# EAGLE schematic main (EAGLE 5.10)

## Sheet 1 of 2
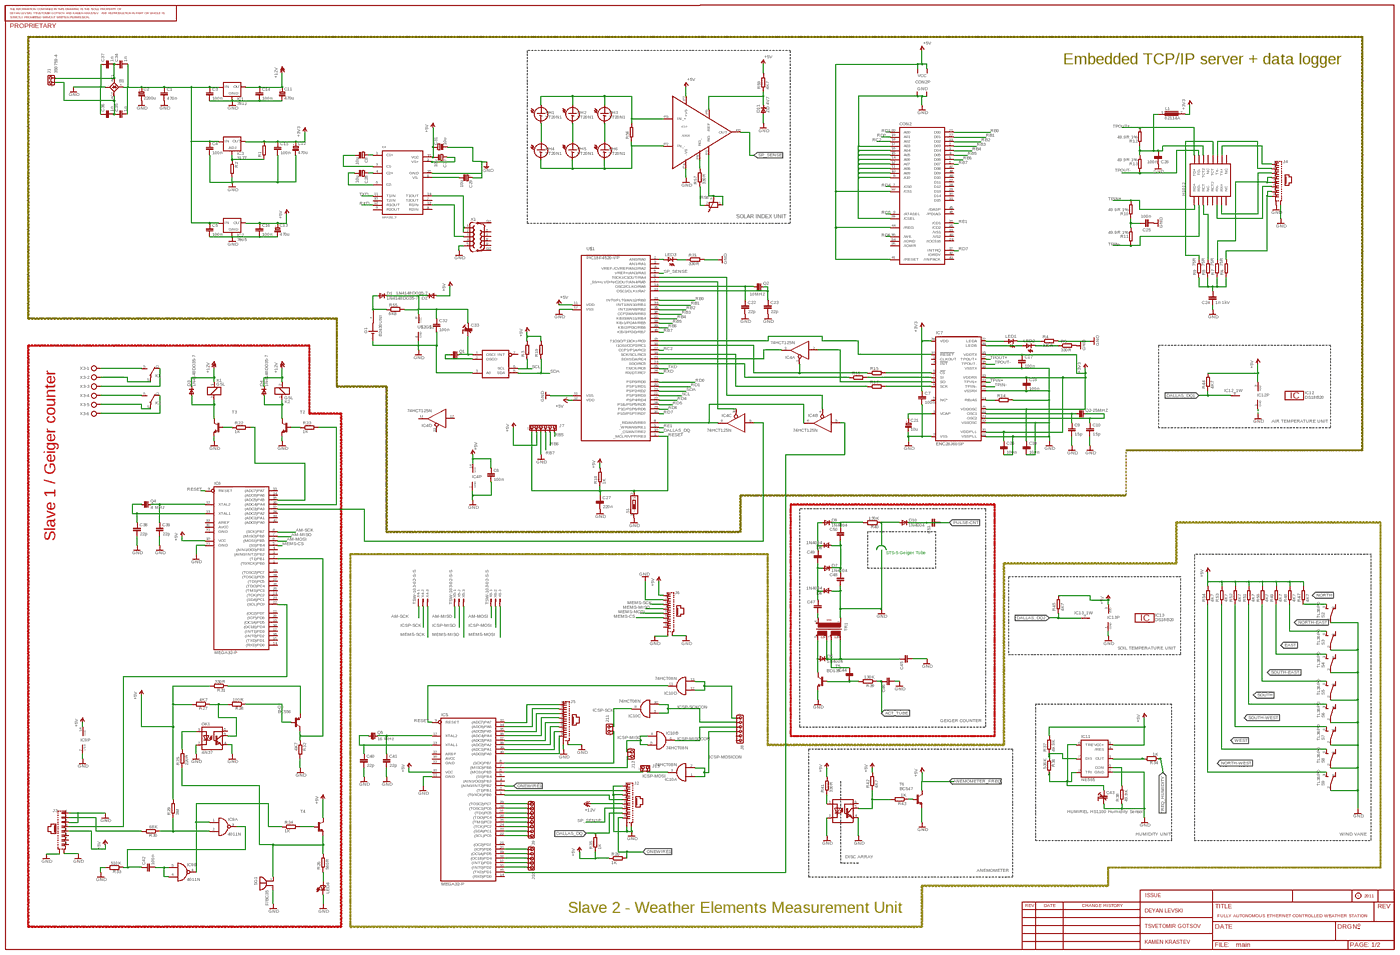
[diagram p0: schematic, sheet 1, overview]
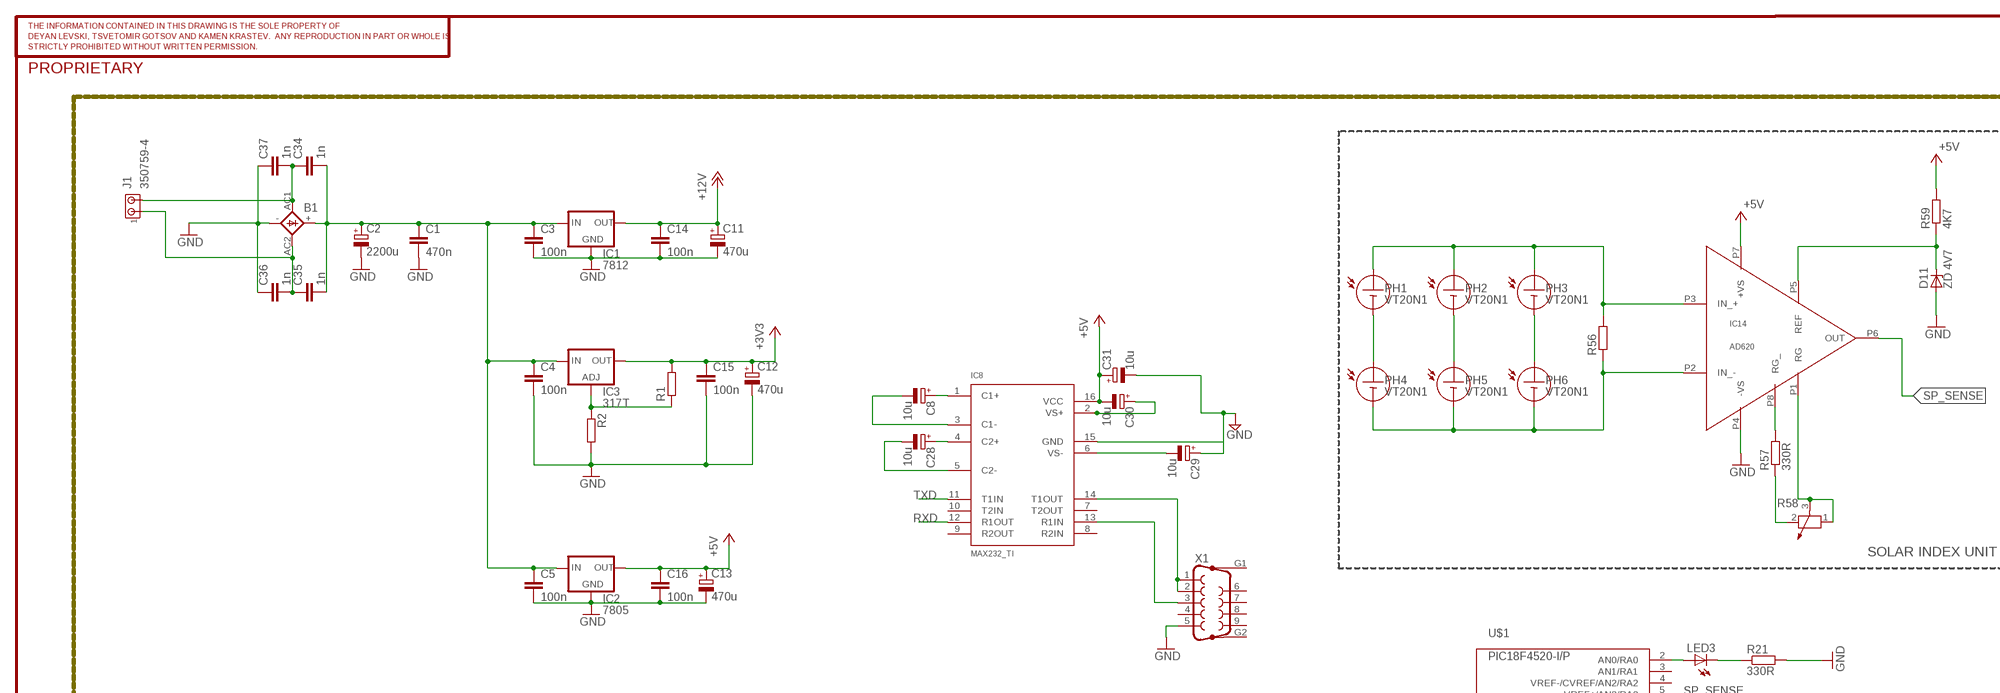
[diagram p1: schematic, sheet 1, part 1 of 4]
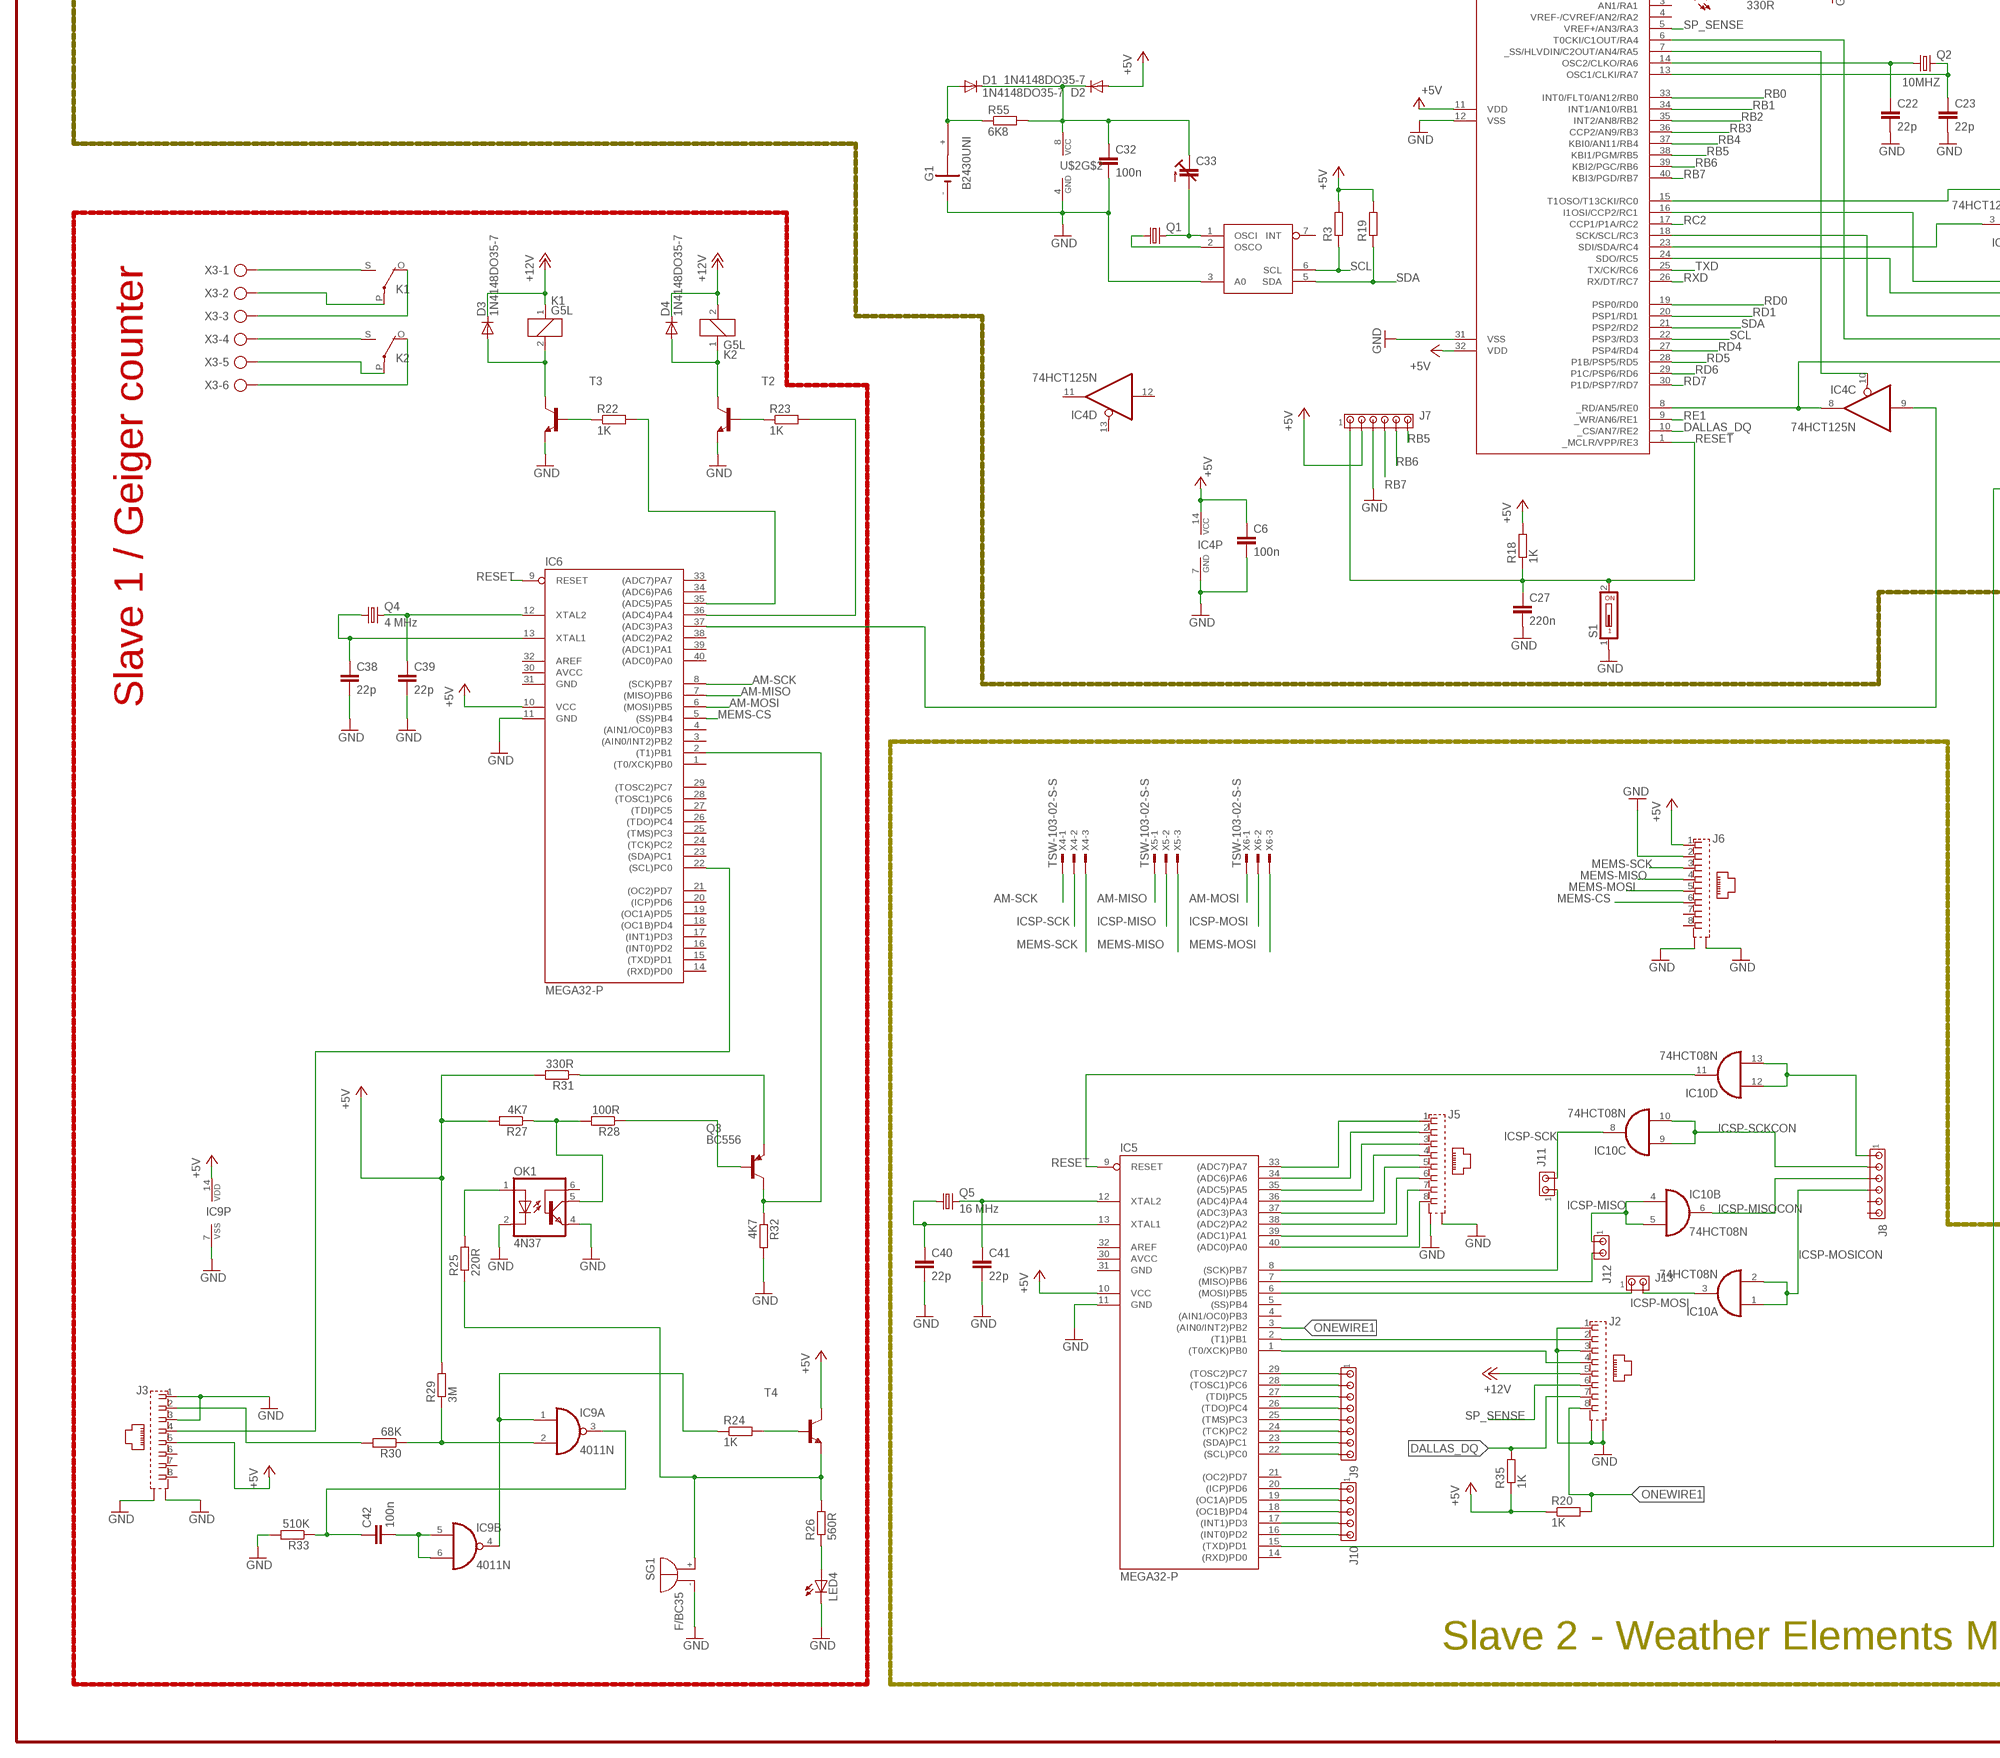
[diagram p2: schematic, sheet 1, part 2 of 4]
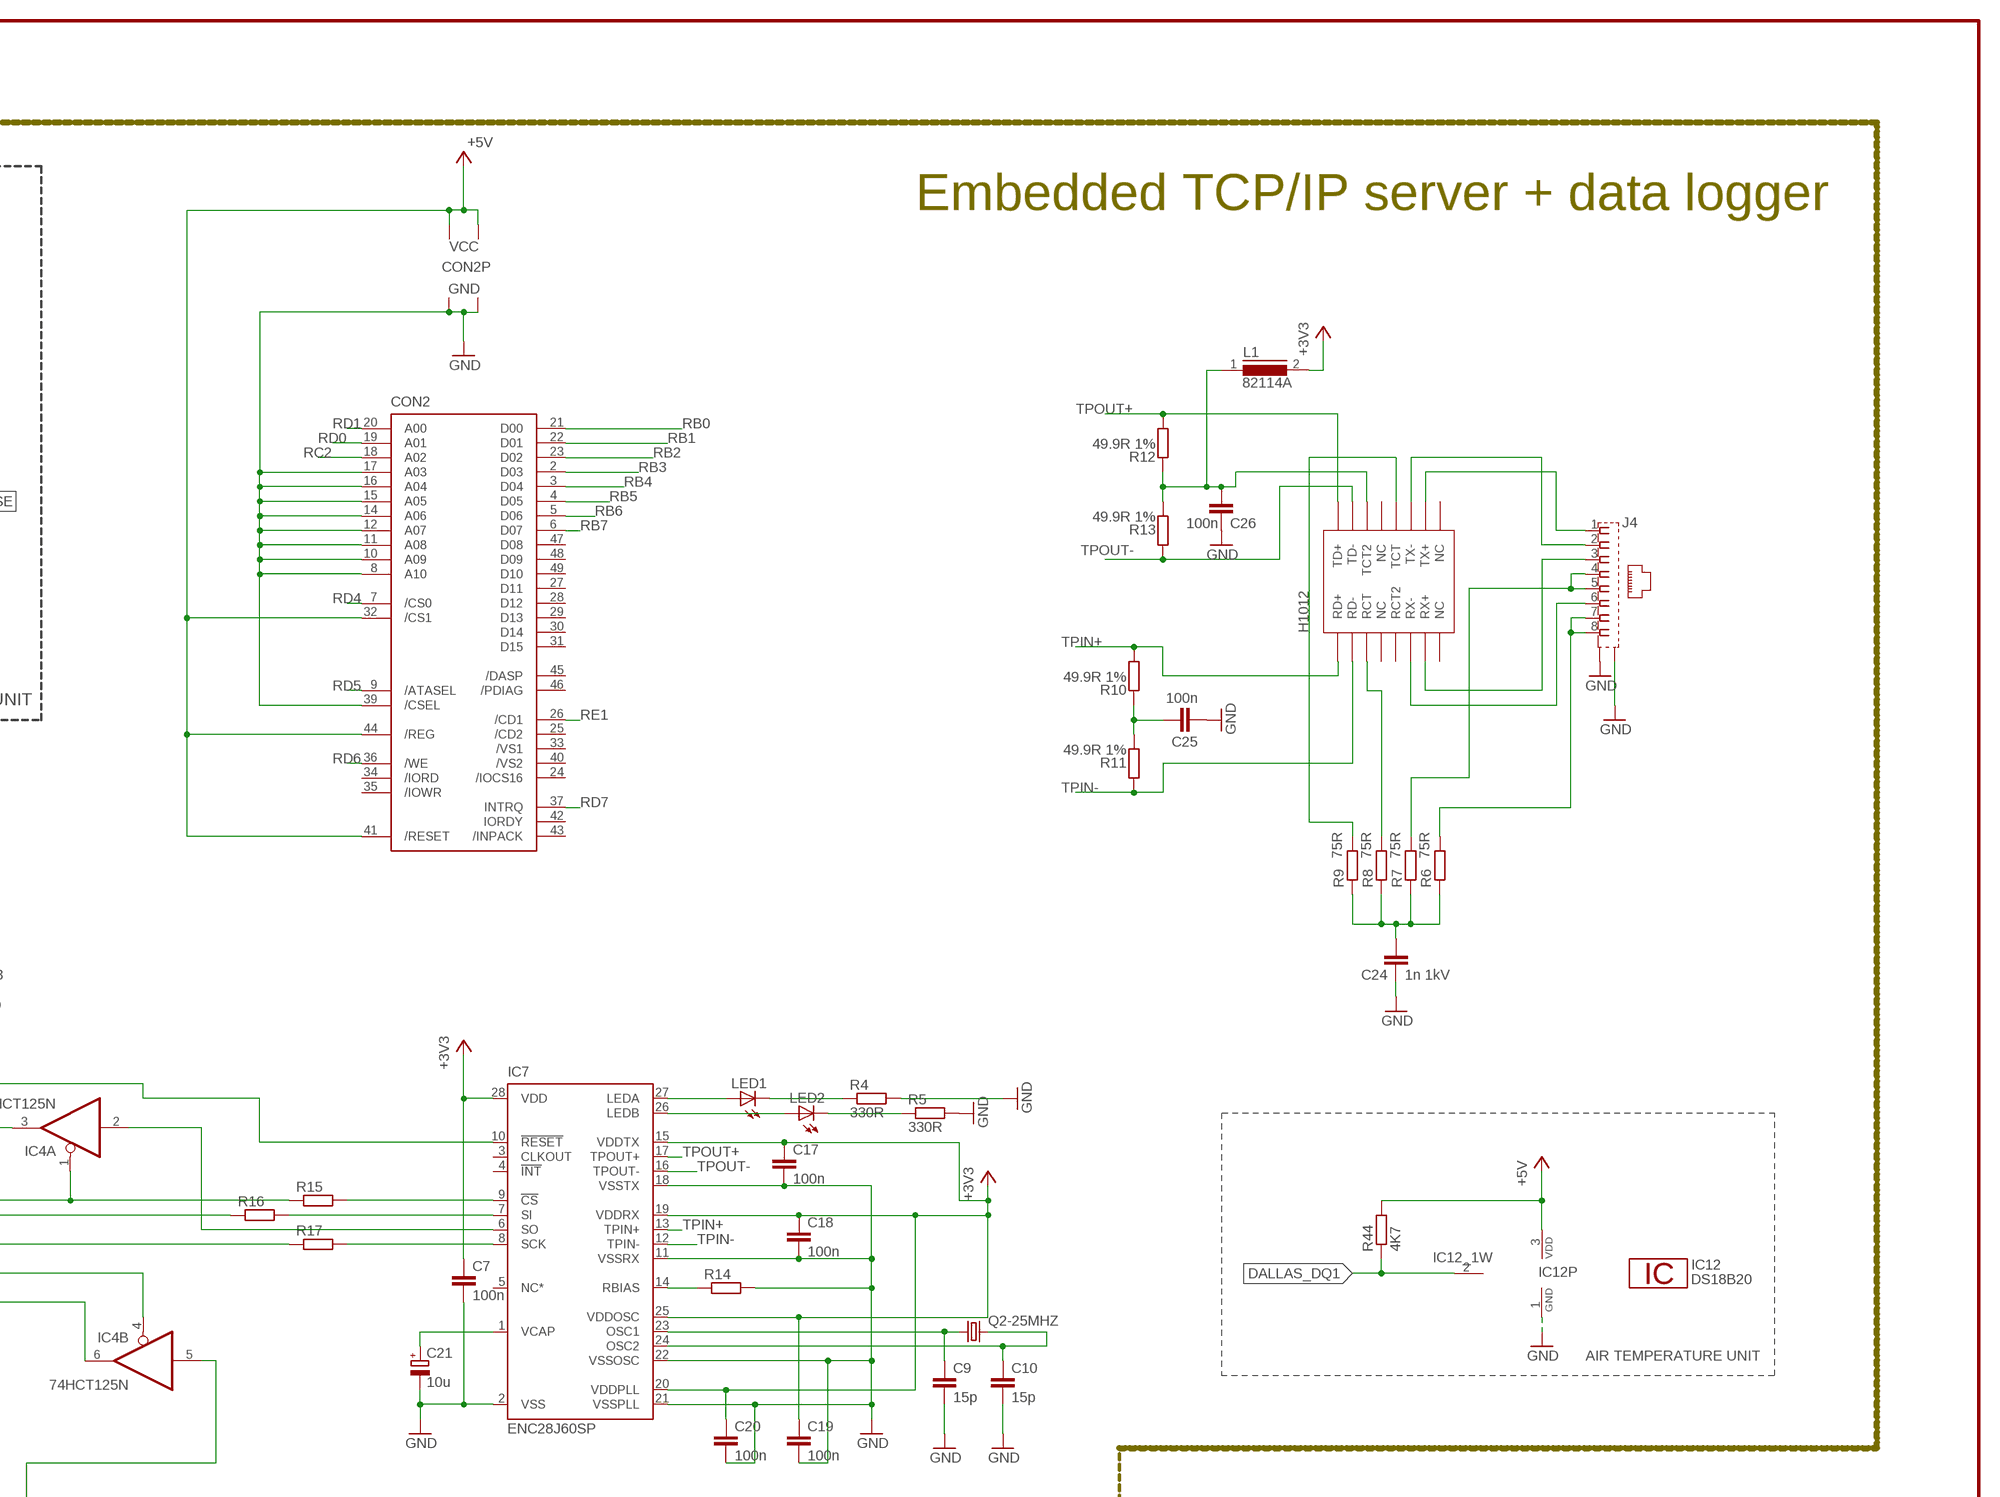
[diagram p3: schematic, sheet 1, part 3 of 4]
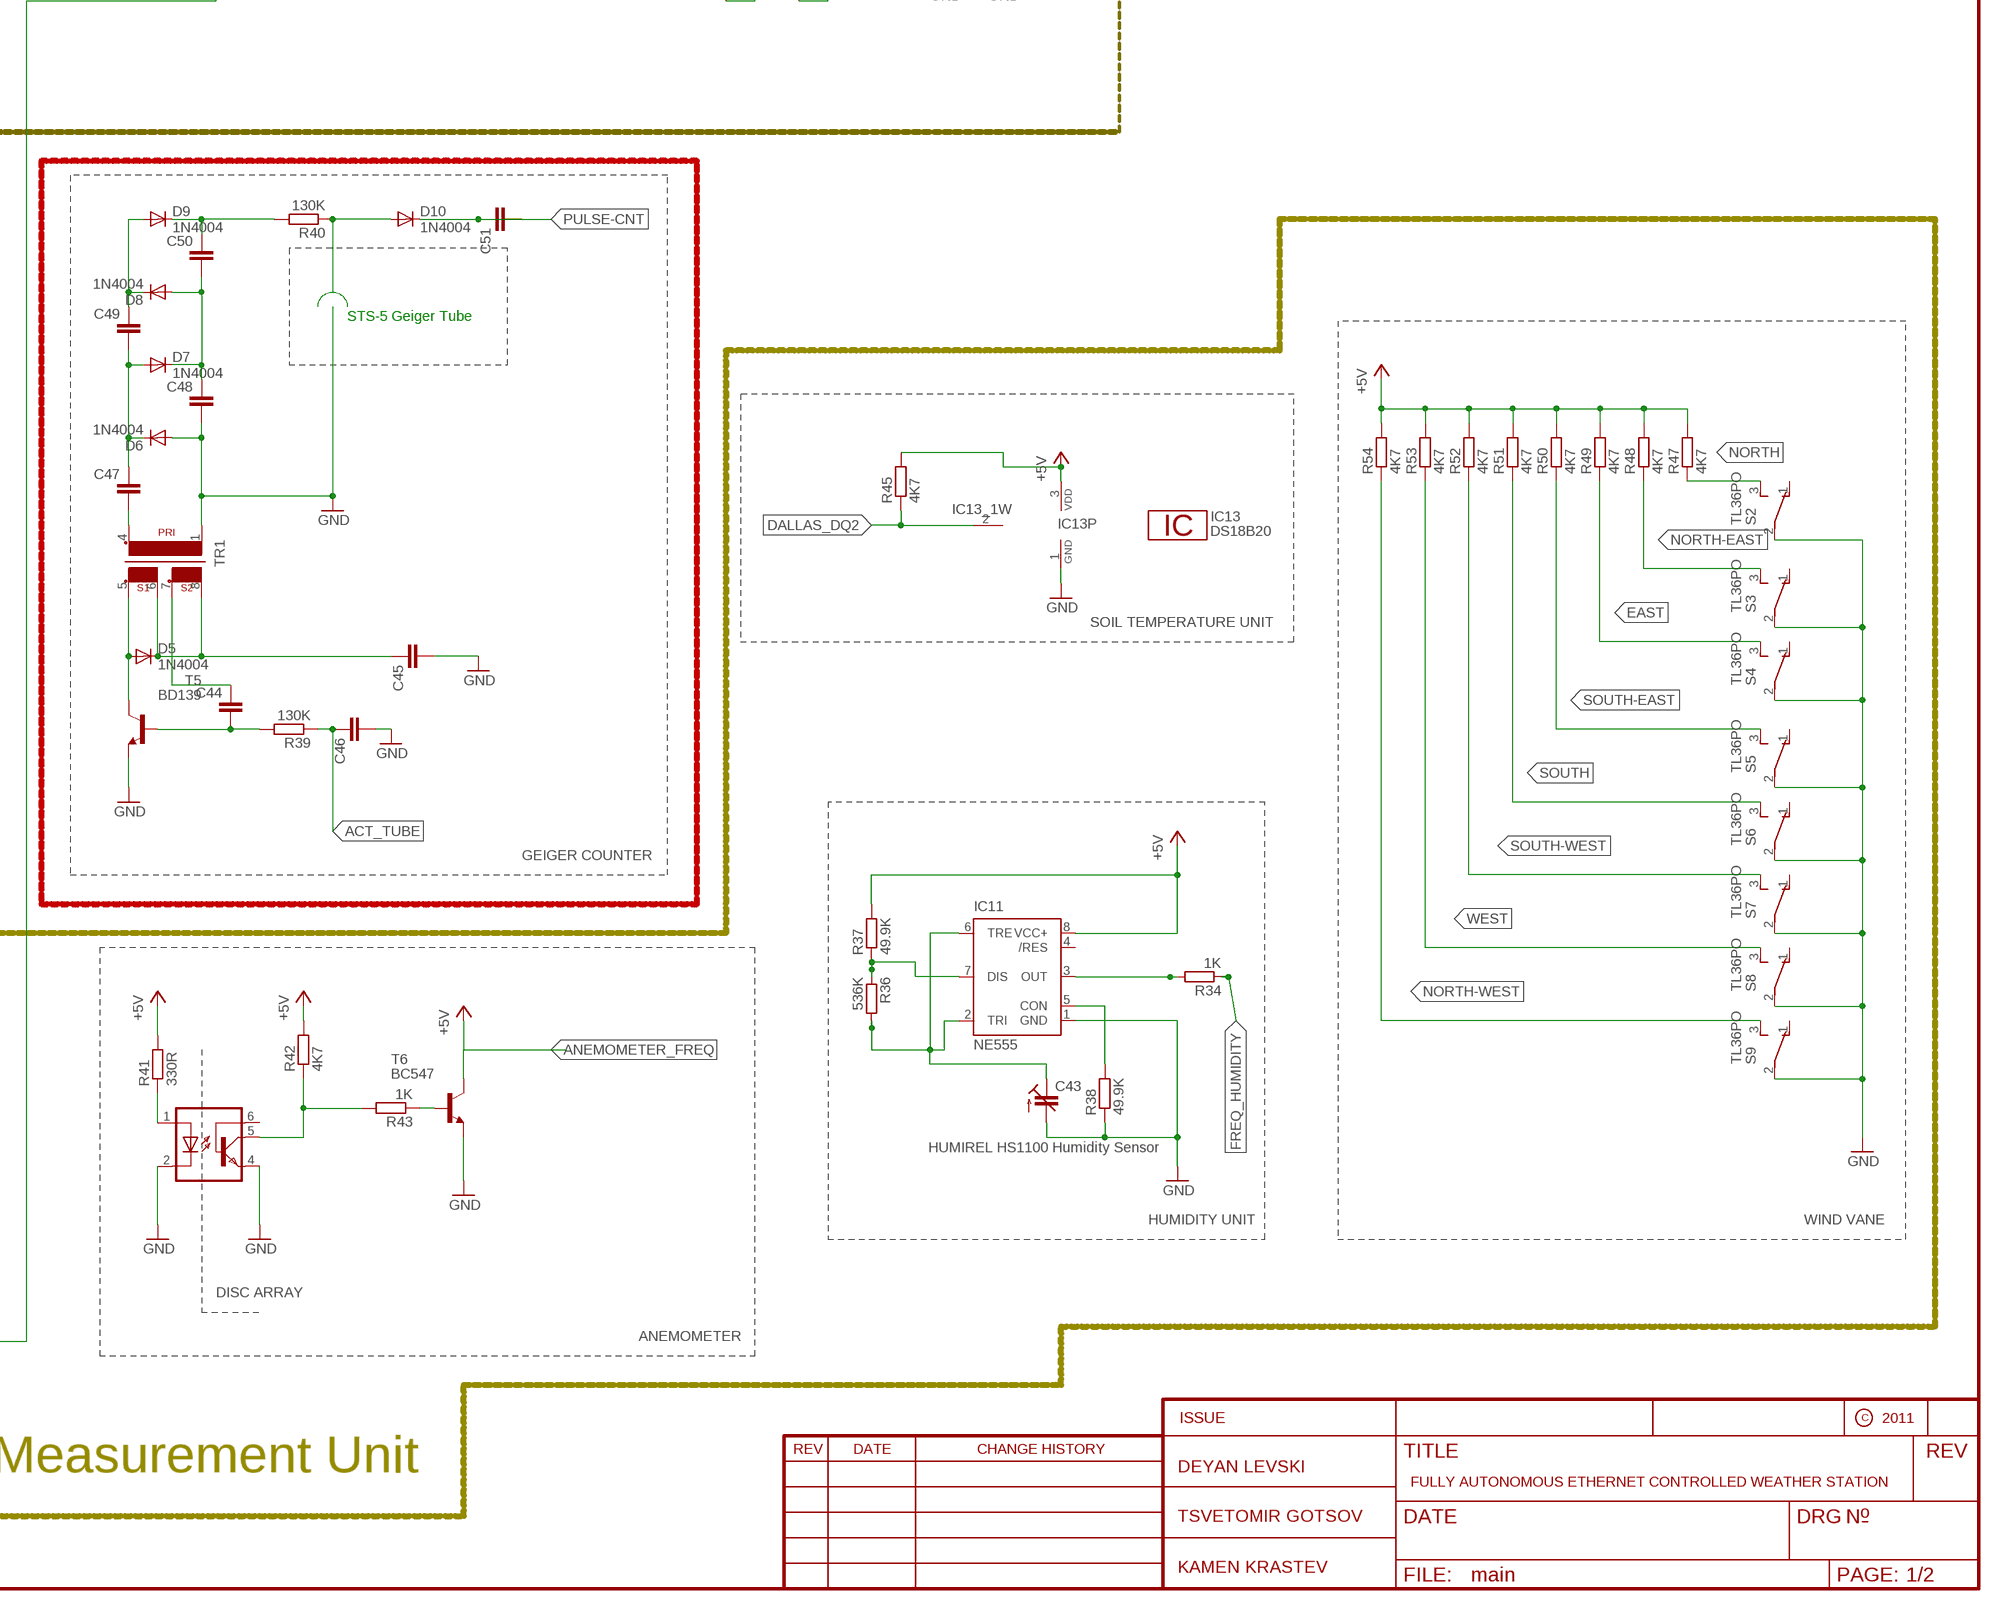
[diagram p4: schematic, sheet 1, part 4 of 4]

### Parts
B1  SKBB  [SKBB]
C1  470n  C-EU050-050X075  [C050-050X075]
C2  2200u  CPOL-EUE5-13  [E5-13]
C3  100n  C-EU050-025X075  [C050-025X075]
C4  100n  C-EU050-025X075  [C050-025X075]
C5  100n  C-EU050-025X075  [C050-025X075]
C6  100n  C-EU050-025X075  [C050-025X075]
C7  100n  C-EU050-025X075  [C050-025X075]
C8  10u  CPOL-EUE2.5-6  [E2,5-6]
C9  15p  C-EU050-024X044  [C050-024X044]
C10  15p  C-EU050-024X044  [C050-024X044]
C11  470u  CPOL-EUE5-10.5  [E5-10,5]
C12  470u  CPOL-EUE5-10.5  [E5-10,5]
C13  470u  CPOL-EUE5-10.5  [E5-10,5]
C14  100n  C-EU050-025X075  [C050-025X075]
C15  100n  C-EU050-025X075  [C050-025X075]
C16  100n  C-EU050-025X075  [C050-025X075]
C17  100n  C-EU050-025X075  [C050-025X075]
C18  100n  C-EU050-025X075  [C050-025X075]
C19  100n  C-EU050-025X075  [C050-025X075]
C20  100n  C-EU050-025X075  [C050-025X075]
C21  10u  CPOL-EUE2.5-6  [E2,5-6]
C22  22p  C-EU050-024X044  [C050-024X044]
C23  22p  C-EU050-024X044  [C050-024X044]
C24  1n 1kV  C-EU050-025X075  [C050-025X075]
C25  100n  C-EU050-025X075  [C050-025X075]
C26  100n  C-EU050-025X075  [C050-025X075]
C27  220n  C-EU050-050X075  [C050-050X075]
C28  10u  CPOL-EUE2.5-6  [E2,5-6]
C29  10u  CPOL-EUE2.5-6  [E2,5-6]
C30  10u  CPOL-EUE2.5-6  [E2,5-6]
C31  10u  CPOL-EUE2.5-6  [E2,5-6]
C32  100n  C-EU050-025X075  [C050-025X075]
C33  C-TRIMM808-1  [CTRIM808-1]
C34  1n  C-EU050-025X075  [C050-025X075]
C35  1n  C-EU050-025X075  [C050-025X075]
C36  1n  C-EU050-025X075  [C050-025X075]
C37  1n  C-EU050-025X075  [C050-025X075]
C38  22p  C-EU050-024X044  [C050-024X044]
C39  22p  C-EU050-024X044  [C050-024X044]
C40  22p  C-EU050-024X044  [C050-024X044]
C41  22p  C-EU050-024X044  [C050-024X044]
C42  100n  C-EU050-025X075  [C050-025X075]
C43  HUMIREL HS1100 Humidity Sensor  C-TRIMM808-1  [CTRIM808-1]
C44  C5/2.5  [C5B2.5]
C45  C5/2.5  [C5B2.5]
C46  C5/2.5  [C5B2.5]
C47  C5/2.5  [C5B2.5]
C48  C5/2.5  [C5B2.5]
C49  C5/2.5  [C5B2.5]
C50  C5/2.5  [C5B2.5]
C51  C5/2.5  [C5B2.5]
CON2  CF-CARD-IDE_MODE  [MI20-50PD-SF]
D1  1N4148DO35-7  [DO35-7]
D2  1N4148DO35-7  [DO35-7]
D3  1N4148DO35-7  [DO35-7]
D4  1N4148DO35-7  [DO35-7]
D5  1N4004  [DO41-10]
D6  1N4004  [DO41-10]
D7  1N4004  [DO41-10]
D8  1N4004  [DO41-10]
D9  1N4004  [DO41-10]
D10  1N4004  [DO41-10]
D11  ZD 4V7  ZENER-DIODEF126-12  [F126Z12]
G1  B2430UNI  [B2430UNI]
IC1  7812  78XXS  [78XXS]
IC2  7805  78XXS  [78XXS]
IC3  317T  LM317TS  [317TS]
IC4  74HCT125N  [DIL14]
IC5  MEGA32-P  [DIL40]
IC6  MEGA32-P  [DIL40]
IC7  ENC28J60SP  [DIL28-3]
IC8  MAX232_TI  [DIL16]
IC9  4011N  [DIL14]
IC10  74HCT08N  [DIL14]
IC11  NE555  [DIL-08]
IC12  DS18B20  [TO92-]
IC13  DS18B20  [TO92-]
IC14  AD620  [DIL8]
J1  350759-4  [350759-4]
J2  555141-1  [555153-1]
J3  555141-1  [555153-1]
J4  555141-1  [555153-1]
J5  555141-1  [555153-1]
J6  555141-1  [555153-1]
J7  MTA06-100  [10X06MTA]
J8  MTA06-100  [10X06MTA]
J9  MTA08-100  [10X08MTA]
J10  MTA05-100  [10X05MTA]
J11  MTA02-100  [10X02MTA]
J12  MTA02-100  [10X02MTA]
J13  MTA02-100  [10X02MTA]
K1  G5L  [G5LE]
K2  G5L  [G5LE]
L1  82114A  [82114A]
LED1  LED3MM  [LED3MM]
LED2  LED3MM  [LED3MM]
LED3  LED3MM  [LED3MM]
LED4  LED3MM  [LED3MM]
OK1  4N37  [DIL06]
OK2  4N35  [DIL06]
PH1  VT20N1  [TO46-VT200]
PH2  VT20N1  [TO46-VT200]
PH3  VT20N1  [TO46-VT200]
PH4  VT20N1  [TO46-VT200]
PH5  VT20N1  [TO46-VT200]
PH6  VT20N1  [TO46-VT200]
Q1  CRYSTALTC26H  [TC26H]
Q2  10MHZ  CRYSTALHC49U-V  [HC49U-V]
Q2-25MHZ  CRYSTALHC49U-V  [HC49U-V]
Q3  BC556  [TO92-EBC]
Q4  4 MHz  CRYSTALHC49U-V  [HC49U-V]
Q5  16 MHz  CRYSTALHC49U-V  [HC49U-V]
R1  R-EU_0207/10  [0207/10]
R2  R-EU_0207/10  [0207/10]
R3  R-EU_0207/10  [0207/10]
R4  330R  R-EU_0207/2V  [0207/2V]
R5  330R  R-EU_0207/2V  [0207/2V]
R6  75R  R-EU_0309/10  [0309/10]
R7  75R  R-EU_0309/10  [0309/10]
R8  75R  R-EU_0309/10  [0309/10]
R9  75R  R-EU_0309/10  [0309/10]
R10  49.9R 1%  R-EU_0309/10  [0309/10]
R11  49.9R 1%  R-EU_0309/10  [0309/10]
R12  49.9R 1%  R-EU_0309/10  [0309/10]
R13  49.9R 1%  R-EU_0309/10  [0309/10]
R14  R-EU_0207/10  [0207/10]
R15  R-EU_0207/10  [0207/10]
R16  R-EU_0207/10  [0207/10]
R17  R-EU_0207/10  [0207/10]
R18  1K  R-EU_0207/10  [0207/10]
R19  R-EU_0207/10  [0207/10]
R20  1K  R-EU_0207/15  [0207/15]
R21  330R  R-EU_0207/2V  [0207/2V]
R22  1K  R-EU_0207/10  [0207/10]
R23  1K  R-EU_0207/10  [0207/10]
R24  1K  R-EU_0207/10  [0207/10]
R25  220R  R-EU_0207/10  [0207/10]
R26  560R  R-EU_0207/10  [0207/10]
R27  4K7  R-EU_0207/10  [0207/10]
R28  100R  R-EU_0207/10  [0207/10]
R29  3M  R-EU_0207/10  [0207/10]
R30  68K  R-EU_0207/10  [0207/10]
R31  330R  R-EU_0207/10  [0207/10]
R32  4K7  R-EU_0207/10  [0207/10]
R33  510K  R-EU_0207/10  [0207/10]
R34  1K  R-EU_0207/15  [0207/15]
R35  1K  R-EU_0207/15  [0207/15]
R36  536K  R-EU_0207/15  [0207/15]
R37  49.9K  R-EU_0207/10  [0207/10]
R38  49.9K  R-EU_0207/10  [0207/10]
R39  130K  R-EU_0207/10  [0207/10]
R40  130K  R-EU_0207/10  [0207/10]
R41  330R  R-EU_0207/10  [0207/10]
R42  4K7  R-EU_0207/10  [0207/10]
R43  1K  R-EU_0207/10  [0207/10]
R44  4K7  R-EU_0207/10  [0207/10]
R45  4K7  R-EU_0207/10  [0207/10]
R47  4K7  R-EU_0207/10  [0207/10]
R48  4K7  R-EU_0207/10  [0207/10]
R49  4K7  R-EU_0207/10  [0207/10]
R50  4K7  R-EU_0207/10  [0207/10]
R51  4K7  R-EU_0207/10  [0207/10]
R52  4K7  R-EU_0207/10  [0207/10]
R53  4K7  R-EU_0207/10  [0207/10]
R54  4K7  R-EU_0207/10  [0207/10]
R55  6K8  R-EU_0207/10  [0207/10]
R56  R-EU_0207/10  [0207/10]
R57  330R  R-EU_0207/2V  [0207/2V]
R58  POTENTIOMETER_PT-10  [PT-10]
R59  4K7  R-EU_0207/2V  [0207/2V]
S1  DS01  [DS-01]
S2  TL36PO  [TL3XPO]
S3  TL36PO  [TL3XPO]
S4  TL36PO  [TL3XPO]
S5  TL36PO  [TL3XPO]
S6  TL36PO  [TL3XPO]
S7  TL36PO  [TL3XPO]
S8  TL36PO  [TL3XPO]
S9  TL36PO  [TL3XPO]
SG1  F/BC35  [F/BC35]
T1  WE-LAN-16PIN_749010011  [WE-LAN_7491010/3]
T2  BC550C-NPN-TO92-EBC  [TO92-EBC]
T3  BC550C-NPN-TO92-EBC  [TO92-EBC]
T4  BC550C-NPN-TO92-EBC  [TO92-EBC]
T5  BD139  [TO126]
T6  BC547  [TO92]
TR1  EE20-2  [EE20-2]
U$1  PIC18F4520-I/P  [DIL40]
U$2  PCF8583P  [DIL08]
X1  F09HP  [F09HP]
X3  AK500/6  [AK500/6]
X4  TSW-103-02-S-S  [TSW-103-02-S-S]
X5  TSW-103-02-S-S  [TSW-103-02-S-S]
X6  TSW-103-02-S-S  [TSW-103-02-S-S]

### Nets
+3V3: C7.1 C12.+ C15.1 C17.1 C18.1 C19.1 C20.1 IC3.2(OUT) IC7.15(VDDTX) IC7.19(VDDRX) IC7.20(VDDPLL) IC7.25(VDDOSC) IC7.28(VDD) L1.2 R1.2
+5V: C6.1 C13.+ C16.1 C30.- C31.+ CON2.13(VCC2) CON2.32(/CS1) CON2.38(VCC1) CON2.41(/RESET) CON2.44(/REG) D2.A IC2.OUT IC4.14(P:VCC) IC5.10(VCC) IC6.10(VCC) IC8.16(VCC) IC9.14(P:VDD) IC11.8(VCC+) IC12.3 IC13.3 IC14.P7(+VS) J3.5 J6.1 J7.5 R3.2 R18.2 R19.2 R20.1 R27.2 R29.2 R31.2 R35.1 R37.2 R41.2 R42.2 R44.2 R45.2 R47.2 R48.2 R49.2 R50.2 R51.2 R52.2 R53.2 R54.2 R59.2 T4.C U$1.11(VDD) U$1.32(VDD)
+12V: C11.+ C14.1 D3.C D4.C IC1.OUT J2.5 K1.1 K2.2
ACT_TUBE: C46.1 R39.1
AM-MISO: IC6.7((MISO)PB6) X5.1
AM-MOSI: IC6.6((MOSI)PB5) X6.1
AM-SCK: IC6.8((SCK)PB7) X4.1
ANEMOMETER_FREQ: T6.3(C) ; supply symbol labelled +5V
DALLAS_DQ: J2.7 R35.2 U$1.10(_CS/AN7/RE2)
DALLAS_DQ1: IC12.2 R44.1
DALLAS_DQ2: IC13.2 R45.1
EAST: R50.1 S5.3(S)
FREQ_HUMIDITY: R34.1
GND: B1.- C1.2 C2.- C3.2 C4.2 C5.2 C6.2 C7.2 C9.2 C10.2 C11.- C12.- C13.- C14.2 C15.2 C16.2 C17.2 C18.2 C19.2 C20.2 C21.- C22.2 C23.2 C24.1 C25.1 C26.2 C27.2 C32.2 C36.1 C37.1 C38.2 C39.2 C40.2 C41.2 C43.2(A) C45.2 C46.2 C48.2 CON2.1(GND1) CON2.8(A10) CON2.10(A09) CON2.11(A08) CON2.12(A07) CON2.14(A06) CON2.15(A05) CON2.16(A04) CON2.17(A03) CON2.39(/CSEL) CON2.50(GND2) D6.A D11.A G1.- IC1.GND IC2.GND IC4.7(P:GND) IC5.11(GND) IC6.11(GND) IC7.2(VSS) IC7.11(VSSRX) IC7.18(VSSTX) IC7.21(VSSPLL) IC7.22(VSSOSC) IC9.7(P:VSS) IC11.1(GND) IC12.1 IC13.1 IC14.P4(-VS) J2.1 J2.3 J2.G1(S1) J2.G2(S2) J3.1 J3.3 J3.G1(S1) J3.G2(S2) J4.G1(S1) J4.G2(S2) J5.G1(S1) J5.G2(S2) J6.2 J6.G1(S1) J6.G2(S2) J7.4 LED4.K(C) OK1.2(C) OK1.4(EMI) OK2.2(C) OK2.4(EMI) R2.2 R4.2 R5.2 R14.2 R21.2 R32.2 R33.2 R38.1 S1.1 S2.2(P) S3.2(P) S4.2(P) S5.2(P) S6.2(P) S7.2(P) S8.2(P) S9.2(P) SG1.- T2.E T3.E T5.1(E) T6.1(E) TR1.1 U$1.12(VSS) U$1.31(VSS) U$2.3(A0) U$2.4(GND) X1.5
ICSP-MISO: IC10.4(B:I0) IC10.5(B:I1) J12.1 X5.2
ICSP-MISOCON: IC10.6(B:O) J8.4
ICSP-MOSI: IC10.3(A:O) J13.2 X6.2
ICSP-MOSICON: IC10.1(A:I0) IC10.2(A:I1) J8.3
ICSP-SCK: IC10.8(C:O) J11.2 X4.2
ICSP-SCKCON: IC10.9(C:I0) IC10.10(C:I1) J8.5
MEMS-CS: IC6.5((SS)PB4) J6.6
MEMS-MISO: J6.4 X5.3
MEMS-MOSI: J6.5 X6.3
MEMS-SCK: J6.3 X4.3
N$1: B1.AC1 C34.1 C37.2 J1.2
N$2: B1.AC2 C35.1 C36.2 J1.1
N$3: B1.+ C1.1 C2.+ C3.1 C4.1 C5.1 C34.2 C35.2 IC1.IN IC2.IN IC3.3(IN)
N$4: IC4.3(A:O) U$1.23(SDI/SDA/RC4)
N$5: IC3.1(ADJ) R1.1 R2.1
N$6: IC7.8(SCK) R17.2
N$7: C9.1 IC7.23(OSC1) Q2-25MHZ.1
N$8: R17.1 U$1.18(SCK/SCL/RC3)
N$9: C10.1 IC7.24(OSC2) Q2-25MHZ.2
N$10: J4.1 T1.10(TX+)
N$11: IC7.27(LEDA) LED1.A
N$12: IC7.26(LEDB) LED2.A
N$13: LED1.K(C) R4.1
N$14: LED2.K(C) R5.1
N$15: C21.+ IC7.1(VCAP)
N$16: IC7.14(RBIAS) R14.1
N$17: IC4.2(A:I) IC7.6(SO)
N$18: IC7.9(!CS) R15.2
N$19: IC7.10(!RESET) U$1.15(T1OSO/T13CKI/RC0)
N$20: IC4.1(A:OE) R15.1 U$1.16(I1OSI/CCP2/RC1)
N$21: J4.2 T1.11(TX-)
N$22: IC7.7(SI) R16.2
N$23: R16.1 U$1.24(SDO/RC5)
N$24: C22.1 Q2.1 U$1.14(OSC2/CLKO/RA6)
N$25: C23.1 Q2.2 U$1.13(OSC1/CLKI/RA7)
N$26: IC4.9(C:I) IC6.37((ADC3)PA3)
N$27: IC8.14(T1OUT) X1.1 X1.2
N$28: D1.A G1.+ R55.1
N$30: C33.2(A) Q1.2 U$2.1(OSCI)
N$31: Q1.1 U$2.2(OSCO)
N$32: C32.1 C33.1(E) D1.C D2.C R55.2 U$2.8(VCC)
N$33: LED3.K(C) R21.1
N$34: LED3.A U$1.2(AN0/RA0)
N$35: J4.3 T1.7(RX+)
N$36: IC4.6(B:O) IC4.8(C:O) U$1.8(_RD/AN5/RE0)
N$37: IC4.10(C:OE) U$1.7(_SS/HLVDIN/C2OUT/AN4/RA5)
N$38: J4.6 T1.6(RX-)
N$39: R9.2 T1.12(TCT)
N$40: IC4.4(B:OE) U$1.6(T0CKI/C1OUT/RA4)
N$41: IC8.13(R1IN) X1.3
N$42: C39.1 IC6.12(XTAL2) Q4.2
N$43: C38.1 IC6.13(XTAL1) Q4.1
N$44: R8.2 T1.3(RCT)
N$45: J4.4 J4.5 R7.2
N$46: C41.1 IC5.12(XTAL2) Q5.2
N$47: C40.1 IC5.13(XTAL1) Q5.1
N$49: D3.A K1.2 T3.C
N$50: D4.A K2.1 T2.C
N$51: IC6.36((ADC4)PA4) R23.2
N$52: IC6.35((ADC5)PA5) R22.2
N$53: R22.1 T3.B
N$54: R23.1 T2.B
N$55: K1.S(2:S) X3.1
N$56: K1.P(2:P) X3.2
N$57: K1.O(2:O) X3.3
N$58: K2.S(2:S) X3.4
N$59: K2.P(2:P) X3.5
N$60: J4.7 J4.8 R6.2
N$61: K2.O(2:O) X3.6
N$62: C24.2 R6.1 R7.1 R8.1 R9.1
N$63: IC9.1(A:I0) IC9.4(B:O) R24.1
N$64: R24.2 T4.B
N$65: IC9.2(A:I1) R29.1 R30.1
N$66: C25.2 R10.1 R11.2
N$67: R25.1 R26.2 SG1.+ T4.E
N$68: LED4.A R26.1
N$69: OK1.1(A) R25.2
N$71: OK1.5(COL) R27.1 R28.2
N$72: Q3.E R31.1
N$73: IC6.2((T1)PB1) Q3.C R32.1
N$74: Q3.B R28.1
N$75: C42.2 IC9.5(B:I0) IC9.6(B:I1)
N$76: C42.1 IC9.3(A:O) R33.1
N$77: C29.- IC8.6(VS-)
N$78: C26.1 L1.1 R12.1 R13.2 T1.14(TCT2)
N$80: J3.2 R30.2
N$81: IC6.22((SCL)PC0) J3.4
N$82: IC4.5(B:I) IC5.15((TXD)PD1)
N$89: C30.+ IC8.2(VS+)
N$90: C8.+ IC8.1(C1+)
N$93: C8.- IC8.3(C1-)
N$94: C28.+ IC8.4(C2+)
N$96: C28.- IC8.5(C2-)
N$97: IC5.40((ADC0)PA0) J5.8
N$98: IC5.39((ADC1)PA1) J5.7
N$99: C29.+ C31.- IC8.15(GND) ; supply symbol labelled GND
N$100: IC5.38((ADC2)PA2) J5.6
N$101: IC5.37((ADC3)PA3) J5.5
N$102: IC5.36((ADC4)PA4) J5.4
N$103: IC5.35((ADC5)PA5) J5.3
N$104: IC5.34((ADC6)PA6) J5.2
N$105: IC5.33((ADC7)PA7) J5.1
N$106: IC5.2((T1)PB1) J2.2
N$107: IC5.1((T0/XCK)PB0) J2.4
N$111: IC5.6((MOSI)PB5) J13.1
N$113: IC10.12(D:I0) IC10.13(D:I1) J8.6
N$118: IC11.3(OUT) R34.2
N$119: IC5.7((MISO)PB6) J12.2
N$137: IC5.8((SCK)PB7) J11.1
N$138: IC11.7(DIS) R36.1 R37.1
N$139: IC5.29((TOSC2)PC7) J9.1
N$140: IC5.28((TOSC1)PC6) J9.2
N$141: IC5.27((TDI)PC5) J9.3
N$142: IC5.26((TDO)PC4) J9.4
N$143: IC5.25((TMS)PC3) J9.5
N$144: IC5.24((TCK)PC2) J9.6
N$145: IC5.23((SDA)PC1) J9.7
N$146: IC5.22((SCL)PC0) J9.8
N$147: C43.1(E) IC11.2(TRI) IC11.6(TRE) R36.2
N$148: IC5.20((ICP)PD6) J10.1
N$149: IC5.19((OC1A)PD5) J10.2
N$150: IC5.18((OC1B)PD4) J10.3
N$151: IC5.17((INT1)PD3) J10.4
N$152: IC5.16((INT0)PD2) J10.5
N$153: D5.A T5.2(C) TR1.5
N$154: C45.1 D5.C TR1.6 TR1.8
N$155: C44.1 TR1.7
N$156: C44.2 R39.2 T5.3(B)
N$157: C47.2 TR1.4
N$158: IC11.5(CON) R38.2
N$159: C47.1 C49.2 D6.C D7.A
N$160: OK2.1(A) R41.1
N$161: C48.1 C50.2 D7.C D8.A
N$162: C49.1 D8.C D9.A
N$163: OK2.5(COL) R42.1 R43.2
N$164: C50.1 D9.C R40.2
N$165: R43.1 T6.2(B)
N$166: D10.A R40.1
N$168: IC14.P8(RG_) R57.2
N$169: C51.1 D10.C
N$170: R57.1 R58.2
N$171: IC14.P1(RG) R58.1 R58.3
N$172: D11.C IC14.P5(REF) R59.1
N$174: PH1.2 PH4.1
N$175: PH2.2 PH5.1
N$176: PH3.2 PH6.1
N$177: IC14.P3(IN_+) PH1.1 PH2.1 PH3.1 R56.2
N$178: IC14.P2(IN_-) PH4.2 PH5.2 PH6.2 R56.1
NORTH: R48.1 S3.3(S)
NORTH-EAST: R49.1 S4.3(S)
NORTH-WEST: R47.1 S2.3(S)
ONEWIRE1: IC5.3((AIN0/INT2)PB2) J2.8 R20.2
PULSE-CNT: C51.2
RB0: CON2.21(D00) U$1.33(INT0/FLT0/AN12/RB0)
RB1: CON2.22(D01) U$1.34(INT1/AN10/RB1)
RB2: CON2.23(D02) U$1.35(INT2/AN8/RB2)
RB3: CON2.2(D03) U$1.36(CCP2/AN9/RB3)
RB4: CON2.3(D04) U$1.37(KBI0/AN11/RB4)
RB5: CON2.4(D05) J7.1 U$1.38(KBI1/PGM/RB5)
RB6: CON2.5(D06) J7.2 U$1.39(KBI2/PGC/RB6)
RB7: CON2.6(D07) J7.3 U$1.40(KBI3/PGD/RB7)
RC2: CON2.18(A02) U$1.17(CCP1/P1A/RC2)
RD0: CON2.19(A01) U$1.19(PSP0/RD0)
RD1: CON2.20(A00) U$1.20(PSP1/RD1)
RD4: CON2.7(/CS0) U$1.27(PSP4/RD4)
RD5: CON2.9(/ATASEL) U$1.28(P1B/PSP5/RD5)
RD6: CON2.36(/WE) U$1.29(P1C/PSP6/RD6)
RD7: CON2.37(INTRQ) U$1.30(P1D/PSP7/RD7)
RE1: CON2.26(/CD1) U$1.9(_WR/AN6/RE1)
RESET: C27.1 IC5.9(RESET) IC6.9(RESET) IC10.11(D:O) J7.6 R18.1 S1.2 U$1.1(_MCLR/VPP/RE3)
RXD: IC8.12(R1OUT) U$1.26(RX/DT/RC7)
SCL: R3.1 U$1.22(PSP3/RD3) U$2.6(SCL)
SDA: R19.1 U$1.21(PSP2/RD2) U$2.5(SDA)
SOUTH: R52.1 S7.3(S)
SOUTH-EAST: R51.1 S6.3(S)
SOUTH-WEST: R53.1 S8.3(S)
SP_SENSE: IC14.P6(OUT) J2.6 U$1.5(VREF+/AN3/RA3)
TPIN+: IC7.13(TPIN+) R10.2 T1.1(RD+)
TPIN-: IC7.12(TPIN-) R11.1 T1.2(RD-)
TPOUT+: IC7.17(TPOUT+) R12.2 T1.16(TD+)
TPOUT-: IC7.16(TPOUT-) R13.1 T1.15(TD-)
TXD: IC8.11(T1IN) U$1.25(TX/CK/RC6)
WEST: R54.1 S9.3(S)
Unconnected: CON2.24(/IOCS16) CON2.25(/CD2) CON2.27(D11) CON2.28(D12) CON2.29(D13) CON2.30(D14) CON2.31(D15) CON2.33(/VS1) CON2.34(/IORD) CON2.35(/IOWR) CON2.40(/VS2) CON2.42(IORDY) CON2.43(/INPACK) CON2.45(/DASP) CON2.46(/PDIAG) CON2.47(D08) CON2.48(D09) CON2.49(D10) G1.+@1(+) G1.+@2(+) G1.+@3(+) G1.+@4(+) G1.-@1(-) IC4.11(D:O) IC4.12(D:I) IC4.13(D:OE) IC5.4((AIN1/OC0)PB3) IC5.5((SS)PB4) IC5.14((RXD)PD0) IC5.21((OC2)PD7) IC5.32(AREF) IC6.1((T0/XCK)PB0) IC6.3((AIN0/INT2)PB2) IC6.4((AIN1/OC0)PB3) IC6.14((RXD)PD0) IC6.15((TXD)PD1) IC6.16((INT0)PD2) IC6.17((INT1)PD3) IC6.18((OC1B)PD4) IC6.19((OC1A)PD5) IC6.20((ICP)PD6) IC6.21((OC2)PD7) IC6.23((SDA)PC1) IC6.24((TCK)PC2) IC6.25((TMS)PC3) IC6.26((TDO)PC4) IC6.27((TDI)PC5) IC6.28((TOSC1)PC6) IC6.29((TOSC2)PC7) IC6.32(AREF) IC6.33((ADC7)PA7) IC6.34((ADC6)PA6) IC6.38((ADC2)PA2) IC6.39((ADC1)PA1) IC6.40((ADC0)PA0) IC7.3(CLKOUT) IC7.4(!INT) IC7.5(NC*) IC8.7(T2OUT) IC8.8(R2IN) IC8.9(R2OUT) IC8.10(T2IN) IC9.8(C:I0) IC9.9(C:I1) IC9.10(C:O) IC9.11(D:O) IC9.12(D:I0) IC9.13(D:I1) IC11.4(/RES) J3.6 J3.7 J3.8 J6.7 J6.8 J8.1 J8.2 OK1.6(BAS) OK2.6(BAS) S2.1(O) S3.1(O) S4.1(O) S5.1(O) S6.1(O) S7.1(O) S8.1(O) S9.1(O) T1.4(NC) T1.5(RCT2) T1.8(NC) T1.13(NC) U$1.3(AN1/RA1) U$1.4(VREF-/CVREF/AN2/RA2) U$2.7(INT) X1.4 X1.6 X1.7 X1.8 X1.9 X1.G1 X1.G2

### Notes on the sheet
- Embedded TCP/IP server + data logger
- SOLAR INDEX UNIT
- AIR TEMPERATURE UNIT
- Slave 1 / Geiger counter
- STS-5 Geiger Tube
- SOIL TEMPERATURE UNIT
- GEIGER COUNTER
- HUMIDITY UNIT | WIND VANE
- DISC ARRAY
- ANEMOMETER
- Slave 2 - Weather Elements Measurement Unit

## Sheet 2 of 2

## Power pins joined to a net without a drawn wire
AVCC: IC5.30(AVCC) IC6.30(AVCC)
GND: IC5.31(GND) IC6.31(GND) IC10.7(P:GND)
VCC: IC10.14(P:VCC)

## Library data of the parts
B1 = rectifier:SKBB: SEMIKRON RECTIFIER
C1 C3-C7 C9 C10 C14-C20 C22-C27 C32 C34-C42 = rcl:C-EU: CAPACITOR, European symbol
C2 C8 C11-C13 C21 C28-C31 = rcl:CPOL-EU: POLARIZED CAPACITOR, European symbol
C33 = resistor:C-TRIMM: Trimm capacitor
C43 = rcl:C-TRIMM: Trimm capacitor
C44-C51 = capacitor-wima:C: CAPACITOR naming: grid - package width
CON2 = con-hirose:CF-CARD-IDE_MODE: Compact Flash Adapter Type I or II without Eject Button Source: con-hirose.lbr from Bob Starr <rtzaudio@mindspring.com>
D1-D4 = diode:1N4148: DIODE high speed (Philips)
D5-D10 = diode:1N4004: DIODE general purpose rectifier, 1 A
D11 = diode:ZENER-DIODE: Z-Diode
G1 = battery:B2430UNI: LI BATTERY
IC1 IC2 = v-reg:78XXS: VOLTAGE REGULATOR
IC3 = v-reg:LM317TS: VOLTAGE REGULATOR
IC4 = 74xx-eu:74*125: Quad bus BUFFER, 3-state
IC5 IC6 = atmel:MEGA32-P: MICROCONTROLLER 32 Kbytes FLASH 2 Kbytes SRAM 1 Kbytes EEPROM USART 8-channel 10 bit ADC Source: www.atmel.com .. doc2503.pdf
IC7 = microchip:ENC28J60: Stand-Alone Ethernet Controller with SPI Interface Source: http://ww1.microchip.com/downloads/en/DeviceDoc/39662c.pdf
IC8 = max232ti:MAX232_TI: MAX232, Texas Instruments Version
IC9 = 40xx:4011: Quad 2-input NAND
IC10 = 74xx-eu:74*08: Quad 2-input AND gate
IC11 = st-microelectronics:NE555: General purpose bipolar Timer
IC12 IC13 = 1wire:DS18B20: Programmable Resolution Digital Thermometer This chip provides a onewire thermosensor with approx. 0.5°C accuracy. A programmable over/undertemperure alarm is available. The precision can be set from 9..12 bits. Notes: Vdd must be applied for accurate measurements at low temperatures, as the parasite power circuit otherwise heats the sensor. If parasite power is used, Vdd has to be connected to GND. The DS1822 is a low-cost thermometer chip, the DS18S20 is similar to the DS18B20, but with 9 Bit precision only. Author: Jan Kandziora <jjj@gmx.de>
IC14 = ad620-classic_symbol:AD620
J1 = con-amp:350759-4: Universal MATE-N-LOK .250" Centerline, 600 V, 19 - 36 A max Source: http://catalog.tycoelectronics.com/ .. ENG_CD_350759_R.pdf
J2-J6 = con-amp:555141-1: AMP connector
J7 J8 = con-amp:MTA06-100: AMP connector
J9 = con-amp:MTA08-100: AMP connector
J10 = con-amp:MTA05-100: AMP connector
J11-J13 = con-amp:MTA02-100: AMP connector
K1 K2 = relay:G5L: RELAY 1 x switch, 10 A/120 V AC, 8 A/30 V ADC, Omron
L1 = inductors:82114A: INDUCTOR
LED1-LED4 = led:LED: LED OSRAM: - CHIPLED LG R971, LG N971, LY N971, LG Q971, LY Q971, LO R971, LY R971 LH N974, LH R974 LS Q976, LO Q976, LY Q976 LO Q996 - Hyper CHIPLED LW Q18S LB Q993, LB Q99A, LB R99A - SideLED LS A670, LO A670, LY A670, LG A670, LP A670 LB A673, LV A673, LT A673, LW A673 LH A674 LY A675 LS A676, LA A676, LO A676, LY A676, LW A676 LS A679, LY A679, LG A679 - Hyper Micro SIDELED® LS Y876, LA Y876, LO Y876, LY Y876 LT Y87S - SmartLED LW L88C, LW L88S LB L89C, LB L89S, LG L890 LS L89K, LO L89K, LY L89K LS L896, LA L896, LO L896, LY L896 - TOPLED LS T670, LO T670, LY T670, LG T670, LP T670 LSG T670, LSP T670, LSY T670, LOP T670, LYG T670 LG T671, LOG T671, LSG T671 LB T673, LV T673, LT T673, LW T673 LH T674 LS T676, LA T676, LO T676, LY T676, LB T676, LH T676, LSB T676, LW T676 LB T67C, LV T67C, LT T67C, LS T67K, LO T67K, LY T67K, LW E67C LS E67B, LA E67B, LO E67B, LY E67B, LB E67C, LV E67C, LT E67C LW T67C LS T679, LY T679, LG T679 LS T770, LO T770, LY T770, LG T770, LP T770 LB T773, LV T773, LT T773, LW T773 LH T774 LS E675, LA E675, LY E675, LS T675 LS T776, LA T776, LO T776, LY T776, LB T776 LHGB T686 LT T68C, LB T68C - Hyper Mini TOPLED® LB M676 - Mini TOPLED Santana® LG M470 LS M47K, LO M47K, LY M47K Source: http://www.osram.convergy.de LUXEON: - LUMILED® LXK2-PW12-R00, LXK2-PW12-S00, LXK2-PW14-U00, LXK2-PW14-V00 LXK2-PM12-R00, LXK2-PM12-S00, LXK2-PM14-U00 LXK2-PE12-Q00, LXK2-PE12-R00, LXK2-PE12-S00, LXK2-PE14-T00, LXK2-PE14-U00 LXK2-PB12-K00, LXK2-PB12-L00, LXK2-PB12-M00, LXK2-PB14-N00, LXK2-PB14-P00, LXK2-PB14-Q00 LXK2-PR12-L00, LXK2-PR12-M00, LXK2-PR14-Q00, LXK2-PR14-R00 LXK2-PD12-Q00, LXK2-PD12-R00, LXK2-PD12-S00 LXK2-PH12-R00, LXK2-PH12-S00 LXK2-PL12-P00, LXK2-PL12-Q00, LXK2-PL12-R00 Source: www.luxeon.com KINGBRIGHT: KA-3528ASYC Source: www.kingbright.com
OK1 = optocoupler-2:4N37: MOTOROLA OPTO COUPLER
OK2 = optocoupler-2:4N35: MOTOROLA OPTO COUPLER
PH1-PH6 = photo-elements-vcells:VT2*: Photoconductive Cell VT200 Series Source: http://optoelectronics.perkinelmer.com/content/Datasheets/DTS_vt200seriesdatasheet.pdf
Q1 Q2 Q2-25MHZ Q4 Q5 = crystal:CRYSTAL: CRYSTAL
Q3 = transistor-pnp:BC556*: PNP Transistror
R1-R5 R14-R45 R47-R57 R59 = rcl:R-EU_: RESISTOR, European symbol
R6-R13 = resistor:R-EU_: RESISTOR, European symbol
R58 = rcl:POTENTIOMETER_: Potentiometer
S1 = switch-dil:DS01: DIL/CODE SWITCH
S2-S9 = switch:TL36PO: TINY SWITCH ON - ON Source: http://www2.produktinfo.conrad.com/datenblaetter/700000-724999/705152-da-01-de-Subminiaturschalter_TL_36YO.pdf
SG1 = buzzer:F/BC35: BUZZER Source: Spoerle
T1 = wuerth_elektronik_eisos__v6.1:WE-LAN-16PIN: LAN-Transformer WE-LAN 16Pin - Compliant with IEEE 802.3 standards - SMD -- Ethernet -- Power over Ethernet -- 1 Gigabit Ethernet -- Compliant with most IC's for ethernet applications like Intel, AMD, Globespan and Realtek
T2-T4 = transistor:*-NPN-: NPN Transistror BF959 corrected 2008.03.06
T5 = transistor:BD139: NPN TRANSISTOR
T6 = transistor:BC547: NPN TRANSISTOR
TR1 = trafo:EE20-2: TRANSFORMER 1 primary winding, 2 secondary windings ERA
U$1 = pic18fxx20:PIC18*4520: PIC18*4520 Microchip FLASH Microcontroller with A/D DEVICE FEATURES Feature PIC18*4520 Program Memory (bytes) 32768 Program Memory (instructions) 16384 Interupt Sources 20 I/O Ports Ports A, B, C, D, E Capture/Compare/PWM Modules 1 Enhanced Capture/Compare/PWM Modules 1 Parallel Communications (PSP) Yes 10-bit Analog-to-Digital Module 13 input Channels Package Types 40-pin PDIP 44-pin TQFP 44-pin QFN NOTES: F only after 18, means standard voltage range from 4.2v to 5.5v LF after 18, means extended voltage range from 2.0v to 5.5v -E before / denotes extended temperature range from -40°C to +120°C -I before / denotes industrial temperature range from -40°C to +85°C /PT suffix denotes TQFP package /SO suffix denotes SOIC package /SP suffix denotes Skinny Plastic DIP package /P suffix denotes Plastic DIP package /ML suffix denotes QFN package
U$2 = i2c:PCF8583: Clock/calendar with 240 x 8-bit RAM
X1 = con-subd:F09HP: SUB-D
X3 = con-ptr500:AK500/6: CONNECTOR
X4-X6 = con-samtec:TSW-103-02-S-S: THROUGH-HOLE .025" SQ POST HEADER Source: Samtec TSW.pdf